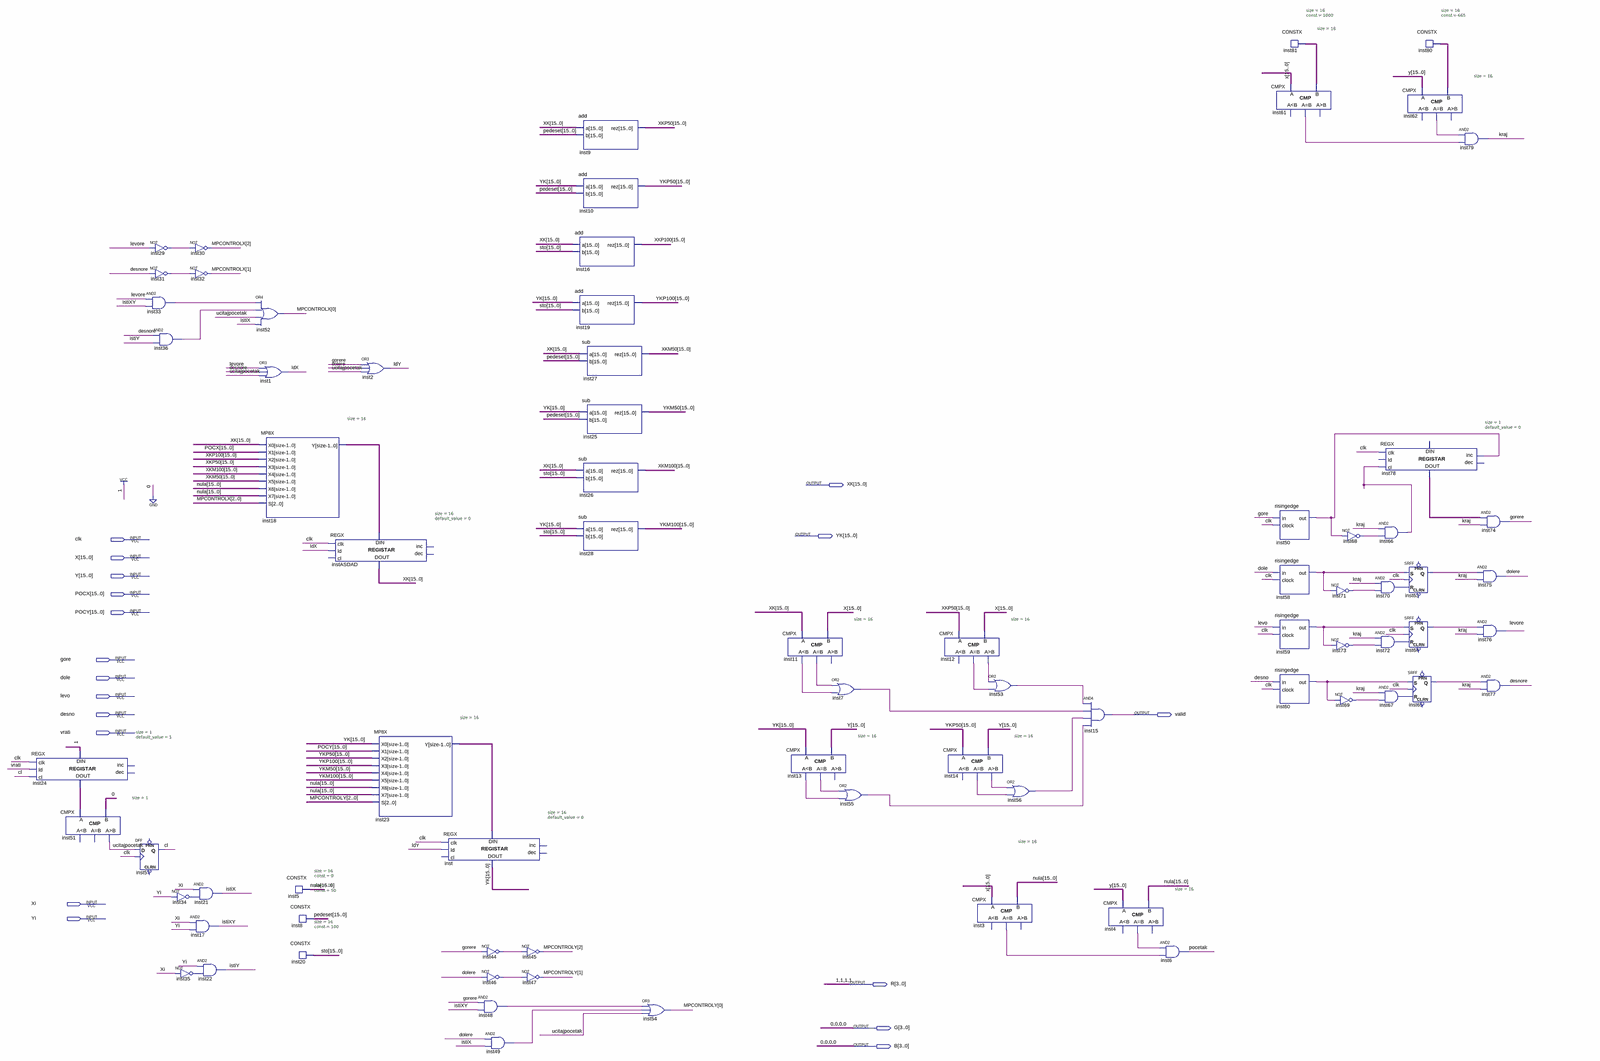
[diagram p0: schematic sheet, whole]
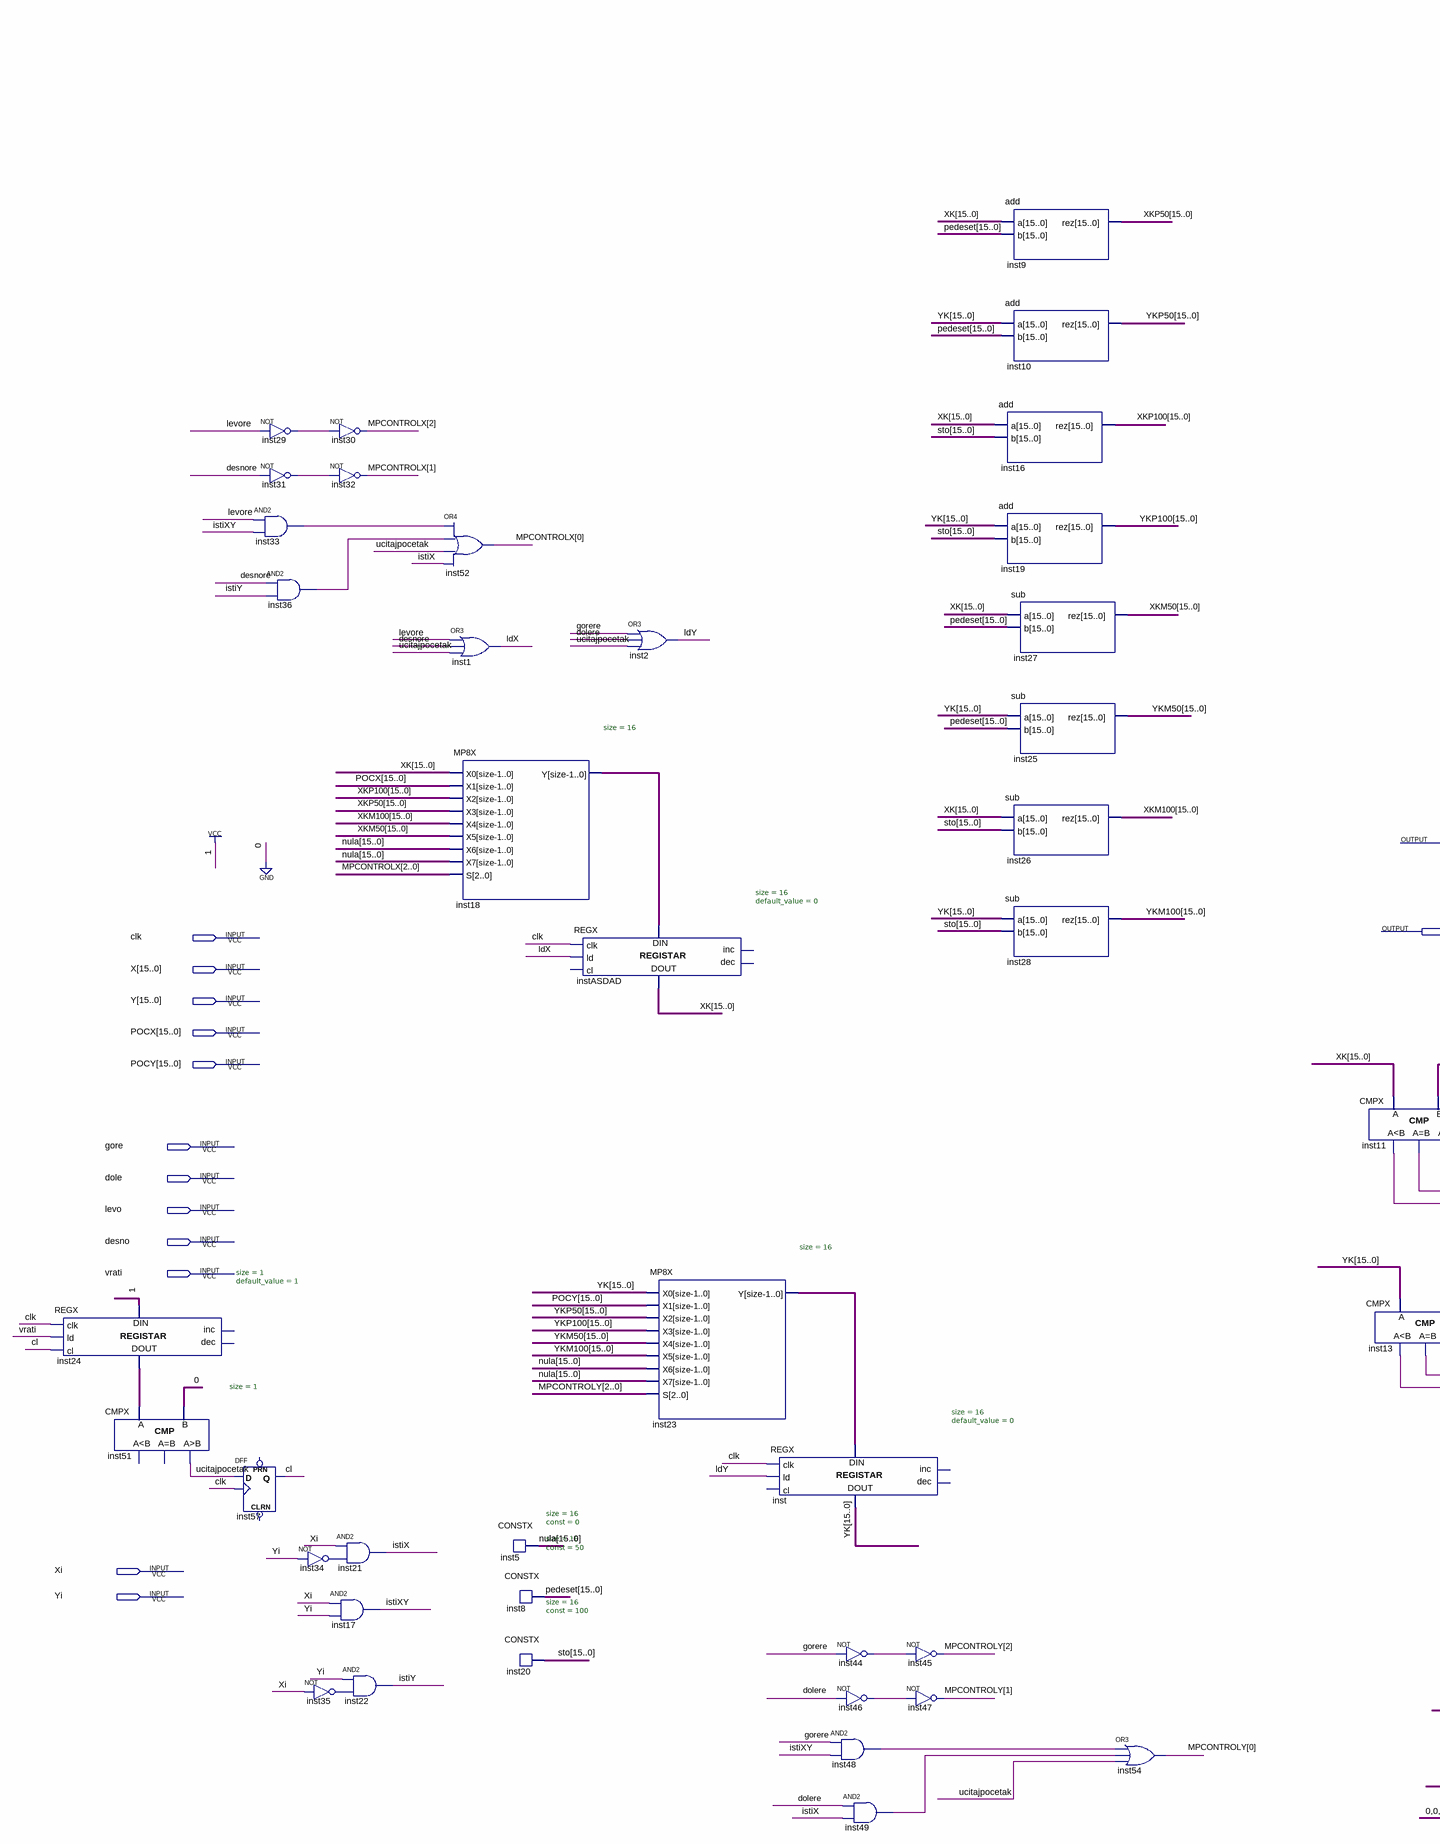
[diagram p1: schematic sheet, left part]
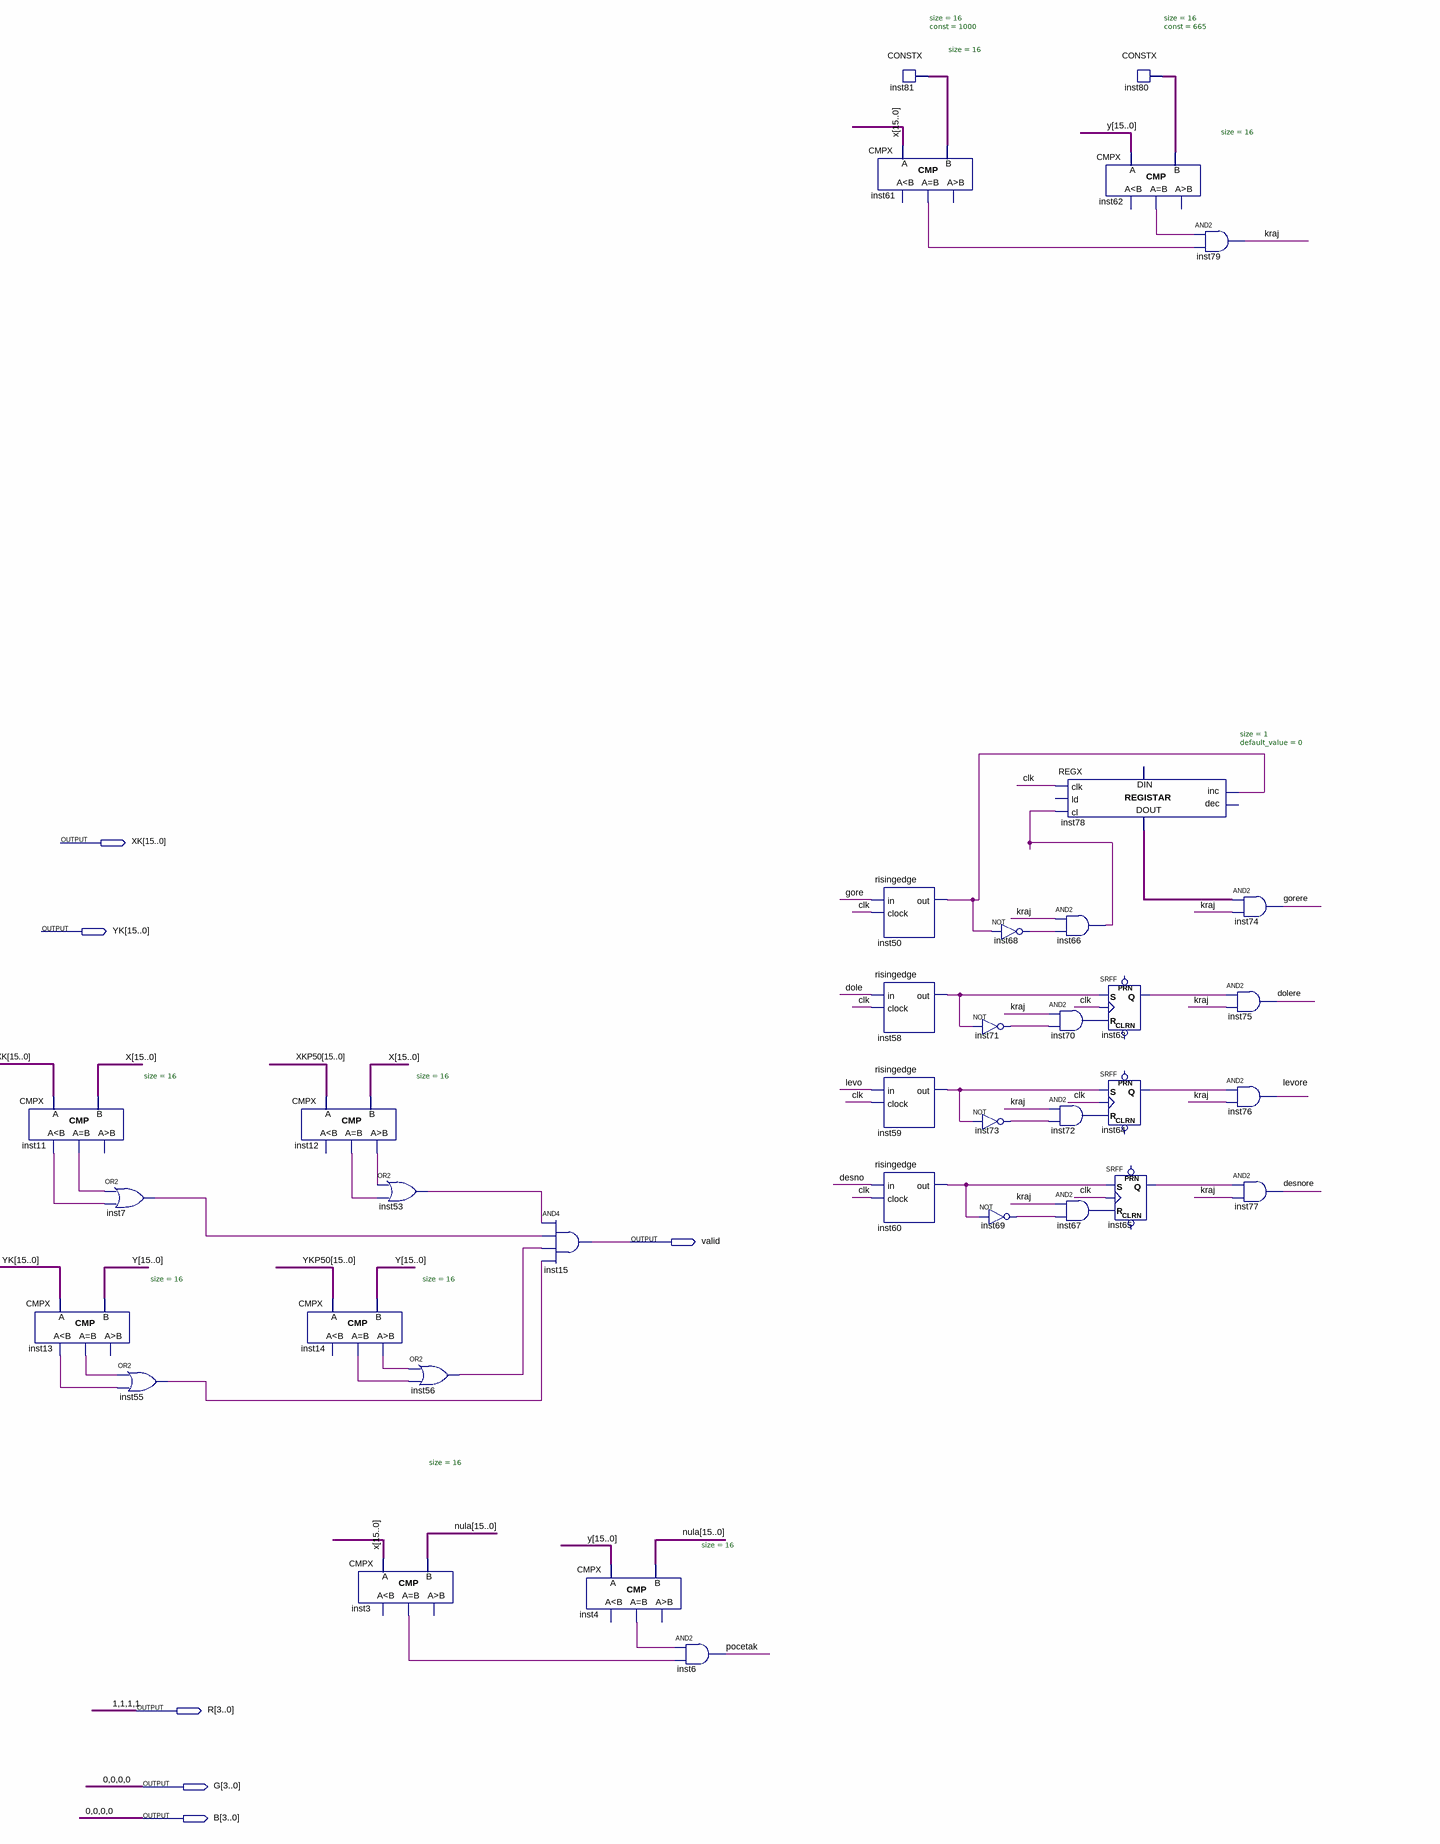
[diagram p2: schematic sheet, right part]
// Quartus schematic kockica2.bdf as structural Verilog: 76 symbols, 18 pins
module kockica2 (
  input  clk,
  input  [15:0] X,
  input  [15:0] Y,
  input  [15:0] POCX,
  input  [15:0] POCY,
  input  gore,
  input  dole,
  input  levo,
  input  desno,
  input  vrati,
  input  Xi,
  input  Yi,
  output [15:0] XK,
  output [15:0] YK,
  output valid,
  output [3:0] R,
  output [3:0] G,
  output [3:0] B
);

  wire cl, desnore, dolere, gorere, inst3_eq, inst4_eq, inst7_out, inst11_eq, inst11_ls, inst12_eq,
       inst12_gr, inst13_eq, inst13_ls, inst14_eq, inst14_gr, inst24_data_out, inst29_out, inst31_out,
       inst33_out, inst34_out, inst35_out, inst36_out, inst44_out, inst46_out, inst48_out, inst49_out,
       inst50_out, inst53_out, inst55_out, inst56_out, inst58_out, inst59_out, inst60_out, inst61_eq,
       inst62_eq, inst63_q, inst64_q, inst65_q, inst66_out, inst67_out, inst68_out, inst69_out, inst70_out,
       inst71_out, inst72_out, inst73_out, inst78_data_out, istiX, istiXY, istiY, kraj, ldX, ldY, levore,
       pocetak, ucitajpocetak;
  wire [2:0] MPCONTROLX, MPCONTROLY;
  wire [15:0] inst18_y, inst23_y, inst80_data, inst81_data, nula, pedeset, sto, XKM50, XKM100, XKP50, XKP100,
       YKM50, YKM100, YKP50, YKP100;

  REGX #(.size(1), .default_value(1)) inst24 (
    .clk(clk), .ld(vrati), .cl(cl), .data_in(1'b1), .data_out(inst24_data_out));  // open: inc, dec
  CMPX #(.size(1)) inst51 (.A(inst24_data_out), .B(1'b0), .gr(ucitajpocetak));  // open: ls, eq
  not inst29 (inst29_out, levore);
  not inst31 (inst31_out, desnore);
  and inst33 (inst33_out, levore, istiXY);
  and inst36 (inst36_out, desnore, istiY);
  DFF inst57 (.CLK(clk), .D(ucitajpocetak), .Q(cl));  // open: CLRN, PRN
  not inst30 (MPCONTROLX[2], inst29_out);
  not inst32 (MPCONTROLX[1], inst31_out);
  not inst34 (inst34_out, Yi);
  and inst17 (istiXY, Xi, Yi);
  not inst35 (inst35_out, Xi);
  and inst21 (istiX, Xi, inst34_out);
  and inst22 (istiY, Yi, inst35_out);
  or inst52 (MPCONTROLX[0], inst33_out, inst36_out, ucitajpocetak, istiX);
  or inst1 (ldX, levore, desnore, ucitajpocetak);
  MP8X #(.size(16)) inst18 (
    .X0(XK), .X1(POCX), .X2(XKP100), .X3(XKP50), .X4(XKM100), .X5(XKM50), .X6(nula), .X7(nula),
    .S(MPCONTROLX), .Y(inst18_y));
  CONSTX #(.size(16), .\const (0)) inst5 (.data(nula));
  CONSTX #(.size(16), .\const (50)) inst8 (.data(pedeset));
  CONSTX #(.size(16), .\const (100)) inst20 (.data(sto));
  REGX #(.size(16), .default_value(0)) instASDAD (
    .clk(clk), .ld(ldX), .data_in(inst18_y), .data_out(XK));  // open: cl, inc, dec
  or inst2 (ldY, gorere, dolere, ucitajpocetak);
  MP8X #(.size(16)) inst23 (
    .X0(YK), .X1(POCY), .X2(YKP50), .X3(YKP100), .X4(YKM50), .X5(YKM100), .X6(nula), .X7(nula),
    .S(MPCONTROLY), .Y(inst23_y));
  REGX #(.size(16), .default_value(0)) inst (
    .clk(clk), .ld(ldY), .data_in(inst23_y), .data_out(YK));  // open: cl, inc, dec
  not inst44 (inst44_out, gorere);
  not inst46 (inst46_out, dolere);
  and inst48 (inst48_out, gorere, istiXY);
  and inst49 (inst49_out, dolere, istiX);
  not inst45 (MPCONTROLY[2], inst44_out);
  not inst47 (MPCONTROLY[1], inst46_out);
  add inst9 (.a(XK), .b(pedeset), .rez(XKP50));
  add inst10 (.a(YK), .b(pedeset), .rez(YKP50));
  add inst16 (.a(XK), .b(sto), .rez(XKP100));
  add inst19 (.a(YK), .b(sto), .rez(YKP100));
  sub inst27 (.a(XK), .b(pedeset), .rez(XKM50));
  sub inst25 (.a(YK), .b(pedeset), .rez(YKM50));
  sub inst26 (.a(XK), .b(sto), .rez(XKM100));
  sub inst28 (.a(YK), .b(sto), .rez(YKM100));
  or inst54 (MPCONTROLY[0], inst48_out, inst49_out, ucitajpocetak);
  CMPX #(.size(16)) inst11 (.A(XK), .B(X), .ls(inst11_ls), .eq(inst11_eq));  // open: gr
  CMPX #(.size(16)) inst13 (.A(YK), .B(Y), .ls(inst13_ls), .eq(inst13_eq));  // open: gr
  or inst7 (inst7_out, inst11_eq, inst11_ls);
  or inst55 (inst55_out, inst13_eq, inst13_ls);
  CMPX #(.size(16)) inst12 (.A(XKP50), .B(X), .eq(inst12_eq), .gr(inst12_gr));  // open: ls
  CMPX #(.size(16)) inst14 (.A(YKP50), .B(Y), .eq(inst14_eq), .gr(inst14_gr));  // open: ls
  CMPX #(.size(16)) inst3 (.A(X), .B(nula), .eq(inst3_eq));  // open: ls, gr
  or inst53 (inst53_out, inst12_gr, inst12_eq);
  or inst56 (inst56_out, inst14_gr, inst14_eq);
  and inst15 (valid, inst53_out, inst7_out, inst56_out, inst55_out);
  CMPX #(.size(16)) inst4 (.A(Y), .B(nula), .eq(inst4_eq));  // open: ls, gr
  and inst6 (pocetak, inst4_eq, inst3_eq);
  CMPX #(.size(16)) inst61 (.A(X), .B(inst81_data), .eq(inst61_eq));  // open: ls, gr
  CONSTX #(.size(16), .\const (1000)) inst81 (.data(inst81_data));
  risingedge inst50 (.in(gore), .clock(clk), .out(inst50_out));
  risingedge inst58 (.in(dole), .clock(clk), .out(inst58_out));
  risingedge inst59 (.in(levo), .clock(clk), .out(inst59_out));
  risingedge inst60 (.in(desno), .clock(clk), .out(inst60_out));
  not inst68 (inst68_out, inst50_out);
  not inst71 (inst71_out, inst58_out);
  not inst73 (inst73_out, inst59_out);
  not inst69 (inst69_out, inst60_out);
  REGX #(.size(1), .default_value(0)) inst78 (
    .clk(clk), .cl(inst66_out), .inc(inst50_out), .data_out(inst78_data_out));  // open: ld, dec, data_in
  and inst66 (inst66_out, kraj, inst68_out);
  and inst70 (inst70_out, kraj, inst71_out);
  and inst72 (inst72_out, kraj, inst73_out);
  and inst67 (inst67_out, kraj, inst69_out);
  CONSTX #(.size(16), .\const (665)) inst80 (.data(inst80_data));
  CMPX #(.size(16)) inst62 (.A(Y), .B(inst80_data), .eq(inst62_eq));  // open: ls, gr
  SRFF inst63 (.S(inst58_out), .R(inst70_out), .CLK(clk), .Q(inst63_q));  // open: PRN, CLRN
  SRFF inst64 (.S(inst59_out), .R(inst72_out), .CLK(clk), .Q(inst64_q));  // open: PRN, CLRN
  SRFF inst65 (.S(inst60_out), .R(inst67_out), .CLK(clk), .Q(inst65_q));  // open: PRN, CLRN
  and inst79 (kraj, inst62_eq, inst61_eq);
  and inst74 (gorere, inst78_data_out, kraj);
  and inst75 (dolere, inst63_q, kraj);
  and inst76 (levore, inst64_q, kraj);
  and inst77 (desnore, inst65_q, kraj);

  assign B = 4'b0000;
  assign G = 4'b0000;
  assign R = 4'b1111;
endmodule
